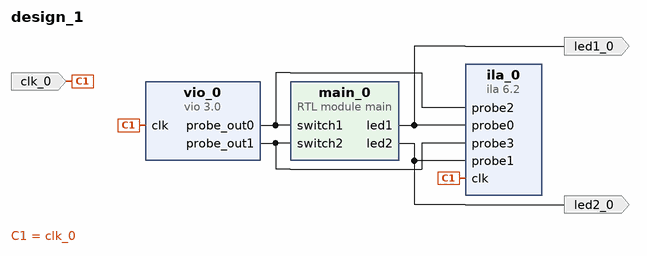
[diagram p0: block diagram of the top level]
# Vivado block design design_1, xc7z010clg400-1, Vivado 2023.2
create_bd_design design_1

create_bd_port -dir O led1_0
create_bd_port -dir O led2_0
create_bd_port -dir I -type clk clk_0

create_bd_cell -type module -reference main main_0
create_bd_cell -type ip -vlnv xilinx.com:ip:vio:3.0 vio_0
set_property -dict {CONFIG.C_NUM_PROBE_IN 0 CONFIG.C_NUM_PROBE_OUT 2} [get_bd_cells vio_0]
create_bd_cell -type ip -vlnv xilinx.com:ip:ila:6.2 ila_0
set_property -dict {CONFIG.C_MONITOR_TYPE Native CONFIG.C_NUM_OF_PROBES 4} [get_bd_cells ila_0]

# ---- connections ----

connect_bd_net -net clk_0_1 [get_bd_ports clk_0] [get_bd_pins ila_0/clk] [get_bd_pins vio_0/clk]
connect_bd_net [get_bd_pins main_0/led1] [get_bd_ports led1_0] [get_bd_pins ila_0/probe0]
connect_bd_net [get_bd_pins main_0/led2] [get_bd_ports led2_0] [get_bd_pins ila_0/probe1]
connect_bd_net [get_bd_pins vio_0/probe_out0] [get_bd_pins ila_0/probe2] [get_bd_pins main_0/switch1]
connect_bd_net [get_bd_pins vio_0/probe_out1] [get_bd_pins ila_0/probe3] [get_bd_pins main_0/switch2]

validate_bd_design
save_bd_design
